# EAGLE design zmpt101b - 3phase din v0.1 (EAGLE 9.6.2)
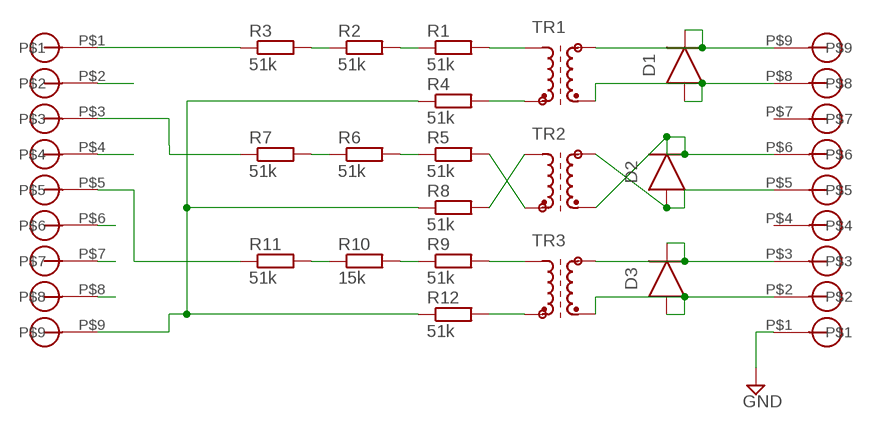
[diagram p0: schematic, sheet 1]

## Parts
D1  DIODE_DO-219-AB(SOD123F)  [SODFL3718X115]
D2  DIODE_DO-219-AB(SOD123F)  [SODFL3718X115]
D3  DIODE_DO-219-AB(SOD123F)  [SODFL3718X115]
R1  51k  R-EU_R1206  [R1206]
R2  51k  R-EU_R1206  [R1206]
R3  51k  R-EU_R1206  [R1206]
R4  51k  R-EU_R1206  [R1206]
R5  51k  R-EU_R1206  [R1206]
R6  51k  R-EU_R1206  [R1206]
R7  51k  R-EU_R1206  [R1206]
R8  51k  R-EU_R1206  [R1206]
R9  51k  R-EU_R1206  [R1206]
R10  15k  R-EU_R1206  [R1206]
R11  51k  R-EU_R1206  [R1206]
R12  51k  R-EU_R1206  [R1206]
TR1  ZMPT101B  [ZMPT101B]
TR2  ZMPT101B  [ZMPT101B]
TR3  ZMPT101B  [ZMPT101B]
U$1  5MMBLOCK_X9  [9/5.08]
U$2  5MMBLOCK_X9  [9/5.08]

## Nets
GND: U$2.P$1
N$1: R3.1 U$1.P$1
N$2: R2.1 R3.2
N$3: R1.1 R2.2
N$4: R1.2 TR1.P$4(A1)
N$5: R4.2 TR1.P$3(E1)
N$6: R4.1 R8.1 R12.1 U$1.P$9
N$7: R7.1 U$1.P$3
N$8: R6.1 R7.2
N$9: R5.1 R6.2
N$10: R8.2 TR2.P$4(A1)
N$11: R5.2 TR2.P$3(E1)
N$12: U$1.P$2
N$13: R11.1 U$1.P$5
N$14: R10.1 R11.2
N$15: R9.1 R10.2
N$16: R9.2 TR3.P$4(A1)
N$17: R12.2 TR3.P$3(E1)
N$18: U$1.P$4
N$19: U$1.P$6
N$20: U$1.P$7
N$21: U$1.P$8
N$22: D1.1(C) TR1.P$1(A2) U$2.P$9
N$23: D1.2(A) TR1.P$2(E2) U$2.P$8
N$24: D2.1(C) TR2.P$2(E2) U$2.P$6
N$25: D2.2(A) TR2.P$1(A2) U$2.P$5
N$26: D3.1(C) TR3.P$1(A2) U$2.P$3
N$27: D3.2(A) TR3.P$2(E2) U$2.P$2

## Power pins joined to a net without a drawn wire
P$4: U$2.P$4
P$7: U$2.P$7

## Library data of the parts
D1-D3 = Diode:DIODE: Diode Rectifier - Generic; CATEGORY: Diode; SUB-CATEGORY: Rectifier
R1-R12 = rcl:R-EU_: RESISTOR, European symbol; SPICEPREFIX: R
TR1-TR3 = ZMPT101B:ZMPT101B: TRANSFORMER; OC_FARNELL: unknown; OC_NEWARK: unknown
U$1 U$2 = 5mm terminal block:5MMBLOCK_X9

## Board
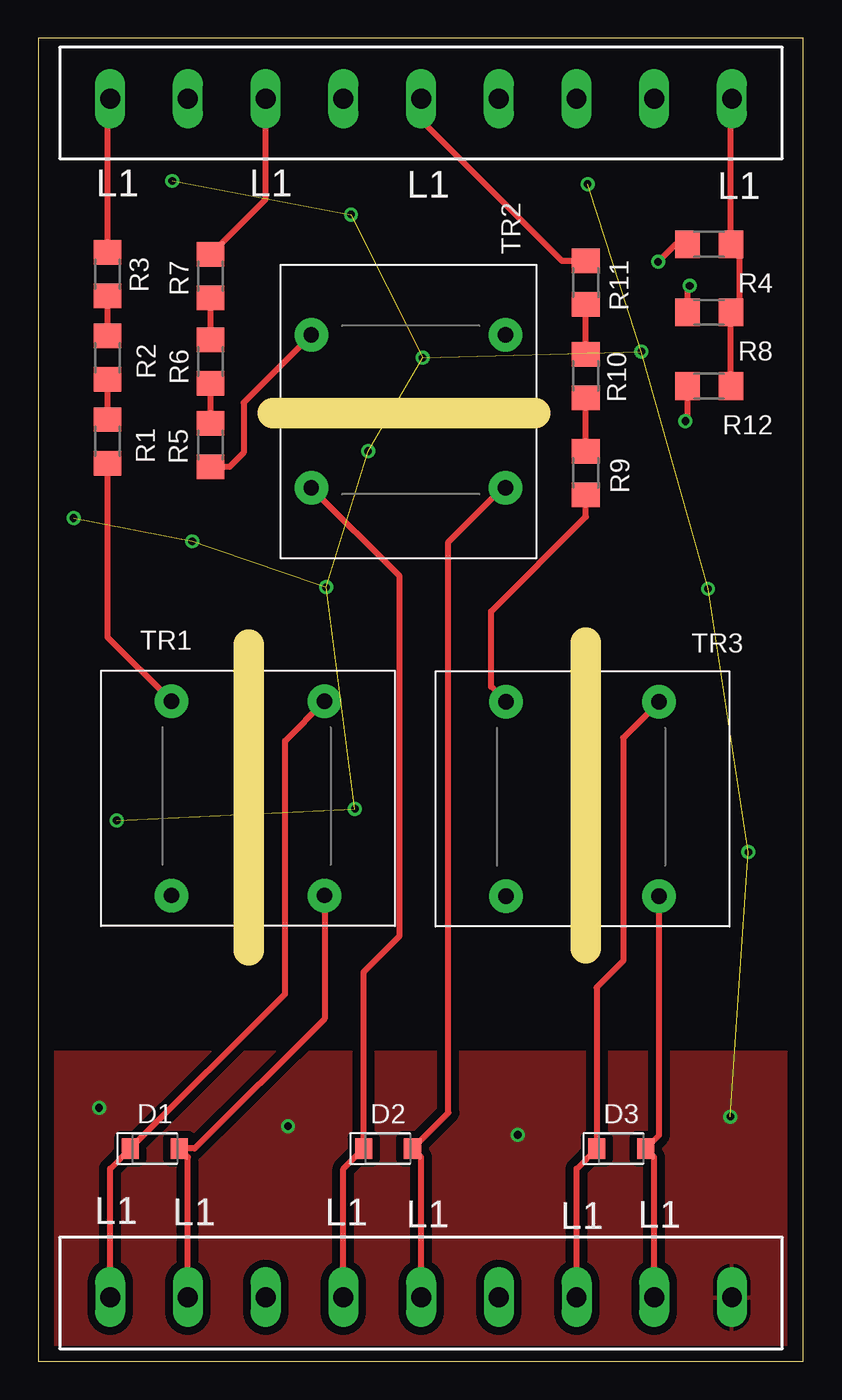
[diagram p1: board, top side]
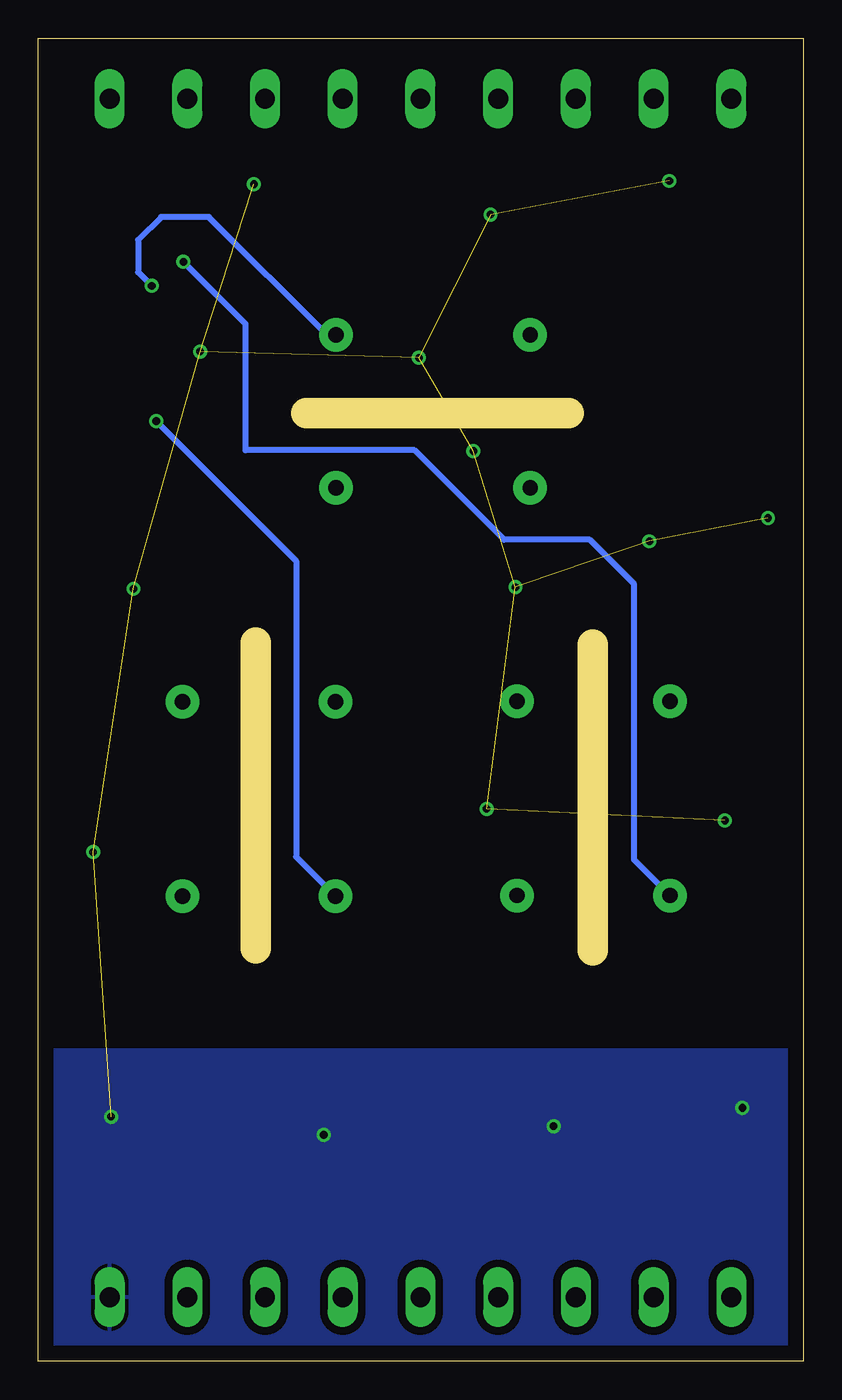
[diagram p2: board, bottom side, seen from below]

Size 50 x 86.5 mm. Coordinates in mm from the lower left corner, seen from the top.
Outline: 0,0 50,0 50,86.5 0,86.5 0,0
Copper layers (1*16): Top 0.035mm / dielectric 0.15mm / Bottom 0.035mm
Design rules "default": minimum track width 6mil, minimum drill 0.35mm, track to track 6mil, track to pad 6mil, pad to pad 6mil, via to via 6mil, smd to smd 6mil, copper to edge 40mil, drill to drill 6mil, minimum pad ring 10mil, minimum via ring 8mil, stop-mask expansion 4mil, vias tented up to drill 0mil, thermal gap 10mil
Milling: 3 lines

### Footprints (pad centres in the part's own frame; a part is rotated, then mirrored left to right if it is on the bottom)
SODFL3718X115 = smd 1.115 x 1.361: 1 -1.6,0; 2 1.6,0
R1206 = smd 1.6 x 1.803: 1 -1.422,0; 2 1.422,0
ZMPT101B = drill 1 pad 2.184: P$1 14.6,14.7; P$2 14.6,2; P$3 4.6,2; P$4 4.6,14.7
9/5.08 = drill 1.3 long: P$1 -2.54,0; P$2 2.54,0; P$3 7.62,0; P$4 12.7,0; P$5 17.78,0; P$6 22.86,0; P$7 27.94,0; P$8 33.02,0; P$9 38.1,0

### Placement (x,y rotation side)
D1  7.62,13.91 0 top
D2  22.86,13.91 0 top
D3  38.1,13.91 0 top
R1  4.52,60.14 270 top
R2  4.52,65.61 270 top
R3  4.52,71.07 270 top
R4  43.84,73.03 180 top
R5  11.25,59.89 270 top
R6  11.25,65.35 270 top
R7  11.25,70.94 270 top
R8  43.84,68.58 180 top
R9  35.78,58.07 270 top
R10  35.78,64.42 270 top
R11  35.78,70.52 270 top
R12  43.84,63.75 180 top
TR1  4.11,28.45 0 top
TR2  15.85,71.7 270 top
TR3  25.98,28.41 0 top
U$1  7.24,82.55 0 top
U$2  42.8,4.19 180 top

### Tracks (layer width: path | path; a pad name or v marks a point on that pad's centre or on a via)
GND  (via drill 0.5)  (13 unrouted)
  other vias: 45.24,15.99 16.32,15.37 20.69,36.12 5.13,35.36 18.81,50.61 10.06,53.61 21.56,59.51 25.12,65.61 39.42,66.02 35.91,76.95 20.44,74.97 8.76,77.17 2.31,55.12 43.78,50.51 46.41,33.29 31.34,14.8 3.98,16.57
  pour Top (isolate 0.508): -5.85,20.23 56.97,20.23 56.97,-6.99 -6.23,-6.99
  pour Bottom (isolate 0.508): -9.3,20.4 55.15,20.4 55.15,-5.32 -10.33,-5.32
N$1
  Top 0.406: U$1.P$1 4.52,82.37 R3.1
N$2
  Top 0.406: R3.2 R2.1
N$3
  Top 0.406: R2.2 R1.1
N$4
  Top 0.406: R1.2 4.52,47.34 TR1.P$4
N$5  (via drill 0.5)
  Top 0.406: v40.51,71.88 41.66,73.03 R4.2
  Bottom 0.406: TR1.P$3 11.05,32.79 11.05,50.8 13.97,53.72 19.56,53.72 25.4,59.56 36.45,59.56 36.45,67.82 v40.51,71.88
N$6
  Top 0.406: R12.1 45.26,68.12 45.47,68.33 | 45.47,68.33 45.85,68.71 45.85,72.44 R4.1 45.26,82.47 U$1.P$9 | R8.1 45.47,68.38 45.47,68.33
N$7
  Top 0.406: R7.1 14.86,75.97 U$1.P$3
N$8
  Top 0.406: R7.2 R6.1
N$9
  Top 0.406: R6.2 R5.1
N$10  (via drill 0.5)
  Top 0.406: v42.58,70.31 42.42,70.15 R8.2
  Bottom 0.406: TR2.P$4 31.13,67.1 38.84,74.81 41.97,74.81 43.47,73.31 43.47,71.2 v42.58,70.31
N$11
  Top 0.406: TR2.P$3 13.42,62.67 13.42,59.4 12.49,58.47 R5.2
N$13
  Top 0.406: R11.1 34.23,71.94 25.02,81.15 U$1.P$5
N$14
  Top 0.406: R10.1 R11.2
N$15
  Top 0.406: R9.1 R10.2
N$16
  Top 0.406: TR3.P$4 29.59,44.1 29.59,49.02 35.78,55.22 R9.2
N$17  (via drill 0.5)
  Top 0.406: R12.2 42.42,61.59 v42.29,61.47
  Bottom 0.406: v42.29,61.47 33.15,52.32 33.15,32.98 TR3.P$3
N$22
  Top 0.406: U$2.P$9 4.7,12.59 D1.1 16.13,24.02 16.13,40.57 TR1.P$1
N$23
  Top 0.406: U$2.P$8 9.78,13.35 D1.2 10.22,13.91 18.71,22.4 TR1.P$2
N$24
  Top 0.406: U$2.P$6 19.94,12.59 D2.1 21.26,25.45 23.62,27.81 23.62,51.32 TR2.P$2
N$25
  Top 0.406: U$2.P$5 25.02,13.35 D2.2 26.8,16.24 26.8,53.56 30.33,57.1 TR2.P$1
N$26
  Top 0.406: U$2.P$3 35.18,12.59 D3.1 36.5,24.43 38.23,26.16 38.23,40.76 TR3.P$1
N$27
  Top 0.406: U$2.P$2 40.26,13.35 D3.2 40.58,14.78 TR3.P$2

### Text on the board
tNames: L1 | L1 | L1 | L1 | L1 | L1 | L1 | L1 | L1 | L1